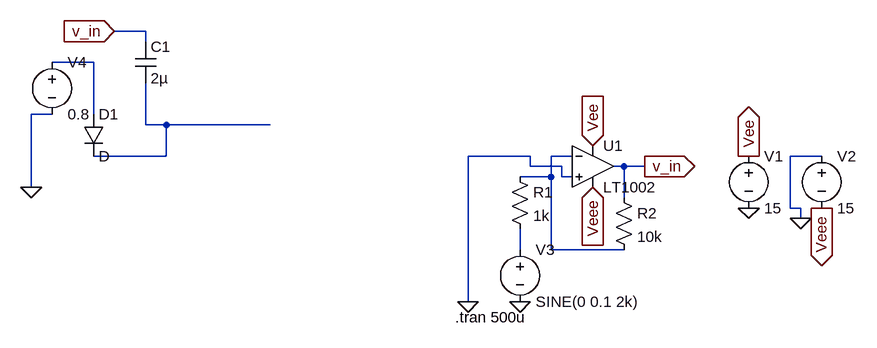
[diagram p0: schematic amplifier.asc]
amplifier.asc, the LTspice schematic file:
Version 4
SHEET 1 880 680
WIRE -480 -64 -528 -64
WIRE -480 -48 -480 -64
WIRE -560 -16 -624 -16
WIRE -624 64 -656 64
WIRE -560 64 -560 -16
WIRE -480 80 -480 16
WIRE -448 80 -480 80
WIRE -288 80 -448 80
WIRE -448 128 -448 80
WIRE -448 128 -560 128
WIRE 112 128 16 128
WIRE 176 128 144 128
WIRE 560 128 512 128
WIRE 112 144 112 128
WIRE 160 144 112 144
WIRE 256 144 240 144
WIRE 288 144 256 144
WIRE 144 160 144 128
WIRE 144 160 96 160
WIRE 160 160 160 144
WIRE 176 160 160 160
WIRE -656 176 -656 64
WIRE 256 192 256 144
WIRE 512 208 512 128
WIRE 528 208 512 208
WIRE 528 224 528 208
WIRE 96 272 96 240
WIRE 144 272 144 160
WIRE 256 272 144 272
WIRE 16 352 16 128
FLAG 96 352 0
FLAG 448 208 0
FLAG 528 224 0
FLAG 16 352 0
FLAG 448 128 Vee
IOPIN 448 128 Out
FLAG 560 208 Veee
IOPIN 560 208 Out
FLAG 208 112 Vee
IOPIN 208 112 In
FLAG 208 176 Veee
IOPIN 208 176 In
FLAG 288 144 v_in
IOPIN 288 144 Out
FLAG -528 -64 v_in
IOPIN -528 -64 In
FLAG -656 176 0
SYMBOL Opamps\\LT1002 208 80 R0
SYMATTR InstName U1
SYMBOL res 80 144 R0
SYMATTR InstName R1
SYMATTR Value 1k
SYMBOL res 240 176 R0
SYMATTR InstName R2
SYMATTR Value 10k
SYMBOL voltage 448 112 R0
WINDOW 123 0 0 Left 2
WINDOW 39 0 0 Left 2
SYMATTR InstName V1
SYMATTR Value 15
SYMBOL voltage 560 112 R0
WINDOW 123 0 0 Left 2
WINDOW 39 0 0 Left 2
SYMATTR InstName V2
SYMATTR Value 15
SYMBOL voltage 96 256 R0
WINDOW 123 0 0 Left 2
WINDOW 39 0 0 Left 2
SYMATTR InstName V3
SYMATTR Value SINE(0 0.1 2k)
SYMBOL cap -496 -48 R0
SYMATTR InstName C1
SYMATTR Value 2µ
SYMBOL diode -576 64 R0
SYMATTR InstName D1
SYMBOL voltage -624 -32 R0
WINDOW 123 0 0 Left 2
WINDOW 39 0 0 Left 2
SYMATTR InstName V4
SYMATTR Value 0.8
TEXT -4 376 Left 2 !.tran 500u

The netlist it stands for:
* amplifier.asc
XU1 0 N003 Vee Veee v_in LT1002  ; pins In+ In- V+ V- OUT
R1 N003 N004 1k
R2 v_in N003 10k
V1 Vee 0 15
V2 0 Veee 15
V3 N004 0 SINE(0 0.1 2k)
C1 v_in N002 2µ
D1 N001 N002 D
V4 N001 0 0.8
.model D D
.lib standard.dio
.tran 500u
.backanno
.end